# EAGLE schematic BluetoothModulePCB (EAGLE 8.1.0)
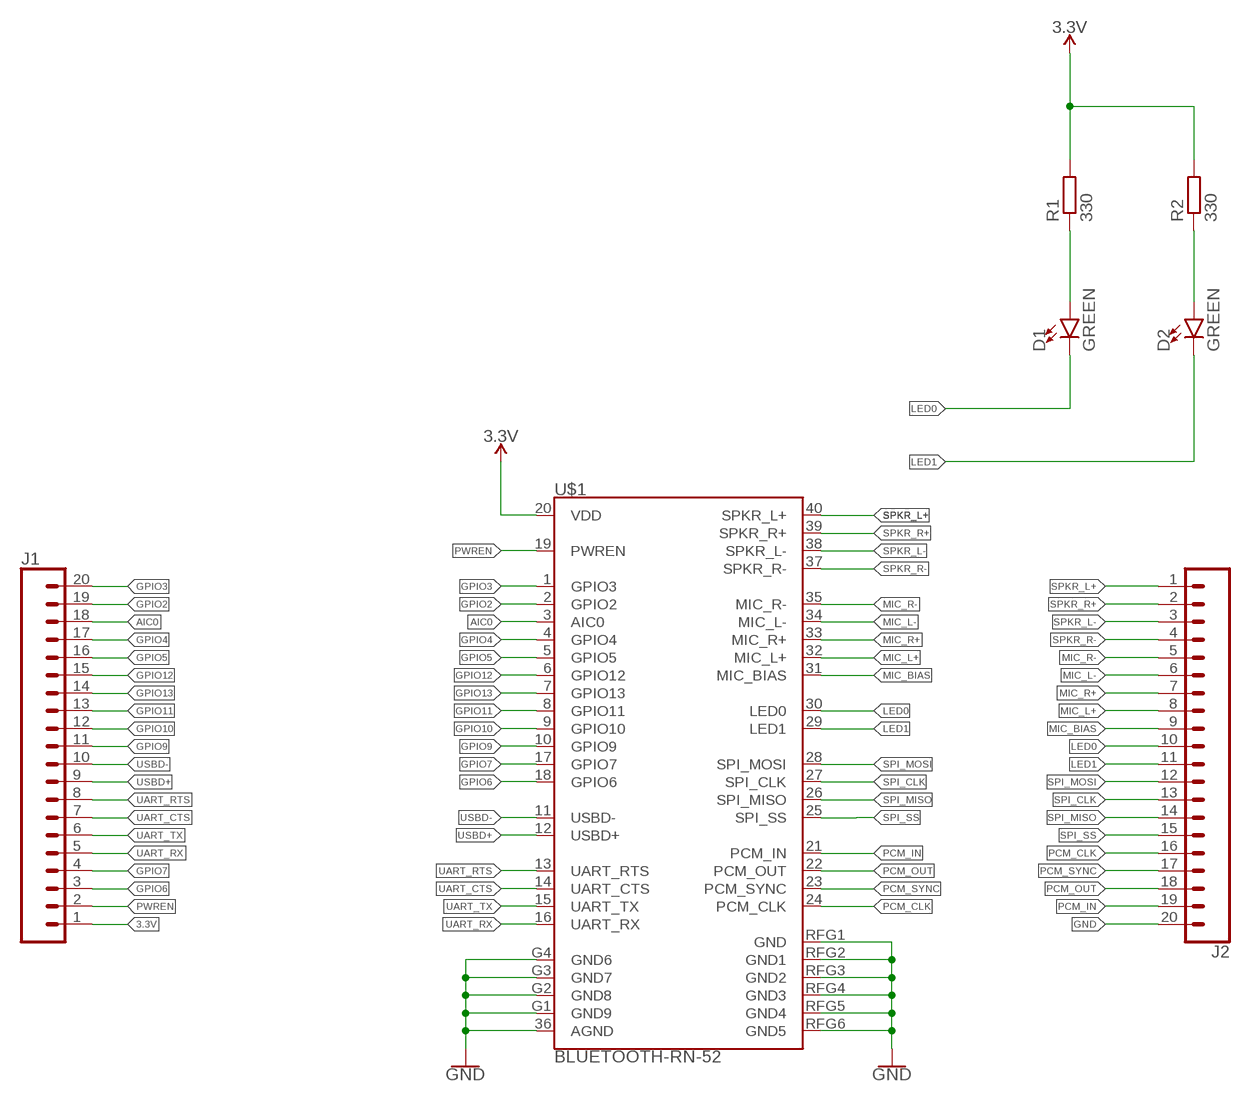
[diagram p0: schematic, sheet 1]

## Parts
D1  GREEN  LED3MM  [LED_3MM]
D2  GREEN  LED3MM  [LED_3MM]
J1  CONN_20  [1X20]
J2  CONN_20  [1X20]
R1  330  R-EU_0204/7  [0204/7]
R2  330  R-EU_0204/7  [0204/7]
U$1  BLUETOOTH-RN-52  [RN-52]

## Nets
3.3V: J1.1 R1.2 R2.2 U$1.20(VDD)
AIC0: J1.18 U$1.3(AIC0)
GND: J2.20 U$1.36(AGND) U$1.G1(GND9) U$1.G2(GND8) U$1.G3(GND7) U$1.G4(GND6) U$1.RFG1(GND) U$1.RFG2(GND1) U$1.RFG3(GND2) U$1.RFG4(GND3) U$1.RFG5(GND4) U$1.RFG6(GND5)
GPIO2: J1.19 U$1.2(GPIO2)
GPIO3: J1.20 U$1.1(GPIO3)
GPIO4: J1.17 U$1.4(GPIO4)
GPIO5: J1.16 U$1.5(GPIO5)
GPIO6: J1.3 U$1.18(GPIO6)
GPIO7: J1.4 U$1.17(GPIO7)
GPIO9: J1.11 U$1.10(GPIO9)
GPIO10: J1.12 U$1.9(GPIO10)
GPIO11: J1.13 U$1.8(GPIO11)
GPIO12: J1.15 U$1.6(GPIO12)
GPIO13: J1.14 U$1.7(GPIO13)
LED0: D1.K(C) J2.10 U$1.30(LED0)
LED1: D2.K(C) J2.11 U$1.29(LED1)
MIC_BIAS: J2.9 U$1.31(MIC_BIAS)
MIC_L+: J2.8 U$1.32(MIC_L+)
MIC_L-: J2.6 U$1.34(MIC_L-)
MIC_R+: J2.7 U$1.33(MIC_R+)
MIC_R-: J2.5 U$1.35(MIC_R-)
N$1: D1.A R1.1
N$2: D2.A R2.1
PCM_CLK: J2.16 U$1.24(PCM_CLK)
PCM_IN: J2.19 U$1.21(PCM_IN)
PCM_OUT: J2.18 U$1.22(PCM_OUT)
PCM_SYNC: J2.17 U$1.23(PCM_SYNC)
PWREN: J1.2 U$1.19(PWREN)
SPI_CLK: J2.13 U$1.27(SPI_CLK)
SPI_MISO: J2.14 U$1.26(SPI_MISO)
SPI_MOSI: J2.12 U$1.28(SPI_MOSI)
SPI_SS: J2.15 U$1.25(SPI_SS)
SPKR_L+: J2.1 U$1.40(SPKR_L+)
SPKR_L-: J2.3 U$1.38(SPKR_L-)
SPKR_R+: J2.2 U$1.39(SPKR_R+)
SPKR_R-: J2.4 U$1.37(SPKR_R-)
UART_CTS: J1.7 U$1.14(UART_CTS)
UART_RTS: J1.8 U$1.13(UART_RTS)
UART_RX: J1.5 U$1.16(UART_RX)
UART_TX: J1.6 U$1.15(UART_TX)
USBD+: J1.9 U$1.12(USBD+)
USBD-: J1.10 U$1.11(USBD-)

## Library data of the parts
D1 D2 = SparkFun-LED:LED: LED (Generic) Standard schematic elements and footprints for 5mm, 3mm, 1206, and 0603 sized LEDs. Generic LEDs with no color specified.; PROD_ID: DIO-08794
J1 J2 = SparkFun-Connectors:CONN_20: Multi connection point. Often used as Generic Header-pin footprint for 0.1 inch spaced/style header connections On any of the 0.1 inch spaced packages, you can populate with these: Break Away Headers - Straight <https://www.sparkfun.com/products/116> (PRT-00116) Break Away Male Headers - Right Angle <https://www.sparkfun.com/products/553> (PRT-00553) Female Headers <https://www.sparkfun.com/products/115> (PRT-00115) Break Away Headers - Machine Pin <https://www.sparkfun.com/products/117> (PRT-00117) Break Away Female Headers - Swiss Machine Pin <https://www.sparkfun.com/products/743> (PRT-00743) For SCREWTERMINALS and SPRING TERMINALS visit here: Screw Terimnals on SparkFun.com <https://www.sparkfun.com/search/results?term=Screw+Terminals> (5mm/3.5mm/2.54mm spacing) This device is also useful as a general connection point to wire up your design to another part of your project. Our various solder wires solder well into these plated through hole pads. Hook-Up Wire - Assortment (Stranded, 22 AWG) <https://www.sparkfun.com/products/11375> (PRT-11375) Hook-Up Wire - Assortment (Solid Core, 22 AWG) <https://www.sparkfun.com/products/11367> (PRT-11367) View the entire wire category on our website here <https://www.sparkfun.com/categories/141> Special notes: Molex polarized connector foot print use with SKU : PRT-08231 with associated crimp pins and housings. 1MM SMD Version SKU: PRT-10208 NOTES ON THE VARIANTS LOCK and LOCK_LONGPADS... This footprint was designed to help hold the alignment of a through-hole component (i.e. 6-pin header) while soldering it into place. You may notice that each hole has been shifted either up or down by 0.005 of an inch from it's more standard position (which is a perfectly straight line). This slight alteration caused the pins (the squares in the middle) to touch the edges of the holes. Because they are alternating, it causes a "brace" to hold the component in place. 0.005 has proven to be the perfect amount of "off-center" position when using our standard breakaway headers. Although looks a little odd when you look at the bare footprint, once you have a header in there, the alteration is very hard to notice. Also,if you push a header all the way into place, it is covered up entirely on the bottom side. Note about LOCK SPECIAL package: This is just like the LOCK variant in that the holes are staggared by 5 mil, but except for the last two holes. They are not altered from the "standard" footprint layout. This is used for a special purpose on the layout of our Graphic LCD Backpack. Make sure you want to use this device before selecting it for you project!
R1 R2 = resistor:R-EU_: RESISTOR, European symbol
U$1 = SparkFun-RF:BLUETOOTH-RN-52: Roving Networks RN-52 Bluetooth Audio Module The RN-52 is an audio module that provides a highly integrated solution for delivering high quality stereo audio in a small form factor with little difficulty. This module is perfect for a project involving hands free audio for your car, remote controlling your media center, or streaming 2-channel audio. SparkFun Products: RN-52 - Bluetooth Audio Module <https://www.sparkfun.com/products/11678> (WRL-11678) Audio Bluetooth Breakout - RN-52 <https://www.sparkfun.com/products/12849> (WRL-12849); PROD_ID: IC-11569; SF_ID: WRL-11678